# EAGLE design current (EAGLE 7.7.0)
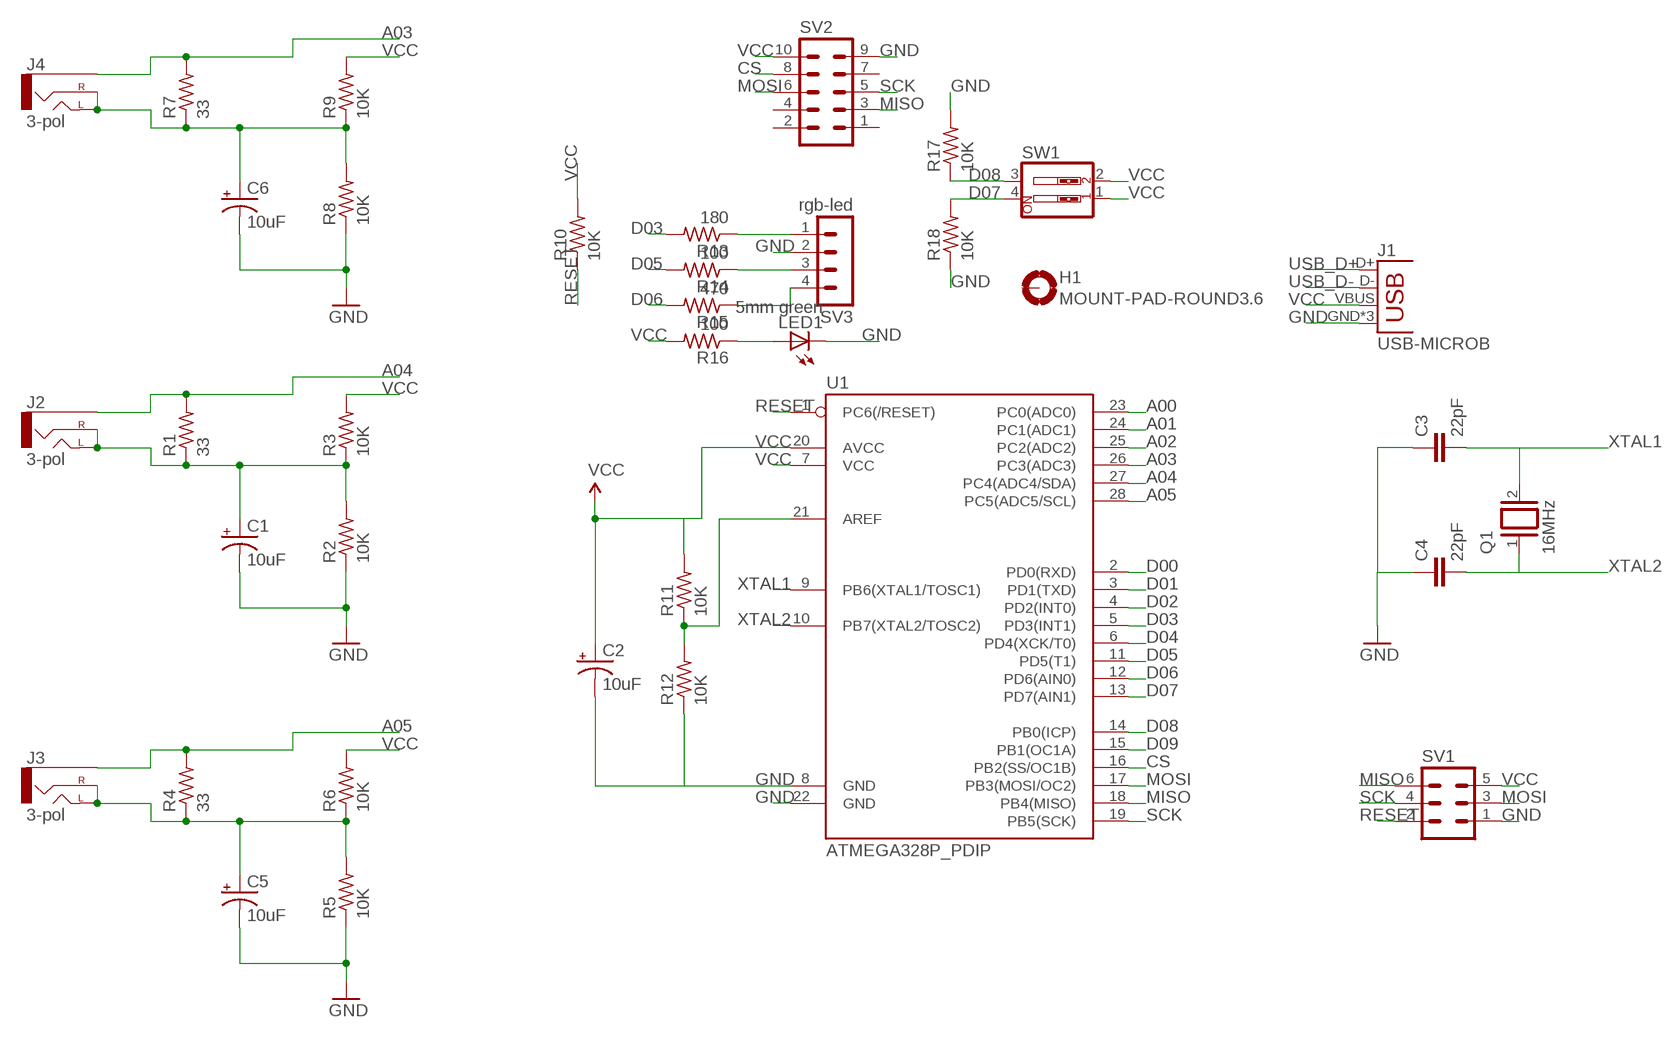
[diagram p0: schematic, sheet 1]

## Parts
C1  10uF  CAP_POLPTH1  [CPOL-RADIAL-100UF-25V]
C2  10uF  CAP_POLPTH2  [CPOL-RADIAL-10UF-25V]
C3  22pF  C5/2.5  [C5B2.5]
C4  22pF  C5/2.5  [C5B2.5]
C5  10uF  CAP_POLPTH1  [CPOL-RADIAL-100UF-25V]
C6  10uF  CAP_POLPTH1  [CPOL-RADIAL-100UF-25V]
H1  MOUNT-PAD-ROUND3.6  [3,6-PAD]
J1  USB-MICROB  [USB-MICROB]
J2  3-pol  AUDIO-JACKPTH  [AUDIO-JACK]
J3  3-pol  AUDIO-JACKPTH  [AUDIO-JACK]
J4  3-pol  AUDIO-JACKPTH  [AUDIO-JACK]
LED1  5mm green  LED5MM  [LED5MM]
Q1  16MHz  XTAL/S  [QS]
R1  33  R-US_0204/5  [0204/5]
R2  10K  R-US_0204/5  [0204/5]
R3  10K  R-US_0204/5  [0204/5]
R4  33  R-US_0204/5  [0204/5]
R5  10K  R-US_0204/5  [0204/5]
R6  10K  R-US_0204/5  [0204/5]
R7  33  R-US_0204/5  [0204/5]
R8  10K  R-US_0204/5  [0204/5]
R9  10K  R-US_0204/5  [0204/5]
R10  10K  R-US_0204/5  [0204/5]
R11  10K  R-US_0204/5  [0204/5]
R12  10K  R-US_0204/5  [0204/5]
R13  180  R-US_0204/5  [0204/5]
R14  100  R-US_0204/5  [0204/5]
R15  470  R-US_0204/5  [0204/5]
R16  100  R-US_0204/5  [0204/5]
R17  10K  R-US_0204/5  [0204/5]
R18  10K  R-US_0204/5  [0204/5]
SV1  MA03-2  [MA03-2]
SV2  MA05-2  [MA05-2]
SV3  rgb-led  MA04-1  [MA04-1]
SW1  SW_DIP-2  [EDG-02]
U1  ATMEGA328P_PDIP  [DIL28-3]

## Nets
A00: U1.23(PC0(ADC0))
A01: U1.24(PC1(ADC1))
A02: U1.25(PC2(ADC2))
A03: J4.SLEEVE R7.2 U1.26(PC3(ADC3))
A04: J2.SLEEVE R1.2 U1.27(PC4(ADC4/SDA))
A05: J3.SLEEVE R4.2 U1.28(PC5(ADC5/SCL))
CS: SV2.8 U1.16(PB2(SS/OC1B))
D00: U1.2(PD0(RXD))
D01: U1.3(PD1(TXD))
D02: U1.4(PD2(INT0))
D03: R13.2 U1.5(PD3(INT1))
D04: U1.6(PD4(XCK/T0))
D05: R14.2 U1.11(PD5(T1))
D06: R15.2 U1.12(PD6(AIN0))
D07: R18.2 SW1.4 U1.13(PD7(AIN1))
D08: R17.1 SW1.3 U1.14(PB0(ICP))
D09: U1.15(PB1(OC1A))
GND: C1.2(-) C2.2(-) C3.1 C4.1 C5.2(-) C6.2(-) J1.GND J1.MT1(GND) J1.MT2(GND) LED1.K(C) R2.1 R5.1 R8.1 R12.1 R17.2 R18.1 SV1.1 SV2.9 U1.8(GND) U1.22(GND)
MISO: SV1.6 SV2.3 U1.18(PB4(MISO))
MOSI: SV1.3 SV2.6 U1.17(PB3(MOSI/OC2))
N$1: C5.1(+) J3.RING(RIGHT) J3.TIP(LEFT) R4.1 R5.2 R6.1
N$2: C1.1(+) J2.RING(RIGHT) J2.TIP(LEFT) R1.1 R2.2 R3.1
N$3: C6.1(+) J4.RING(RIGHT) J4.TIP(LEFT) R7.1 R8.2 R9.1
N$4: R13.1 SV3.1
N$5: R11.1 R12.2 U1.21(AREF)
N$6: R14.1 SV3.3
N$7: R15.1 SV3.4
N$8: LED1.A R16.1
RESET: R10.1 SV1.2 U1.1(PC6(/RESET))
SCK: SV1.4 SV2.5 U1.19(PB5(SCK))
USB_D+: J1.D+
USB_D-: J1.D-
VCC: C2.1(+) J1.VBUS R3.2 R6.2 R9.2 R10.2 R11.2 R16.2 SV1.5 SV2.10 SW1.1 SW1.2 U1.7(VCC) U1.20(AVCC)
XTAL1: C3.2 Q1.2 U1.9(PB6(XTAL1/TOSC1))
XTAL2: C4.2 Q1.1 U1.10(PB7(XTAL2/TOSC2))
Unconnected: H1.B3,6(MOUNT) SV2.1 SV2.2 SV2.4 SV2.7 SV3.2

## Library data of the parts
C1 C5 C6 = SparkFun-Passives:CAP_POL: Capacitor Polarized These are standard SMD and PTH capacitors. Normally 10uF, 47uF, and 100uF in electrolytic and tantalum varieties. Always verify the external diameter of the through hole cap, it varies with capacity, voltage, and manufacturer. The EIA devices should be standard.
C2 = SparkFun-Capacitors:CAP_POL: Capacitor Polarized These are standard SMD and PTH capacitors. Normally 10uF, 47uF, and 100uF in electrolytic and tantalum varieties. Always verify the external diameter of the through hole cap, it varies with capacity, voltage, and manufacturer. The EIA devices should be standard.
C3 C4 = capacitor-wima:C: CAPACITOR naming: grid - package width
H1 = holes:MOUNT-PAD-ROUND: MOUNTING PAD, round
J1 = SparkFun-Connectors:USB: USB Connectors USB-B-PTH is fully proven SKU : PRT-00139/CONN-08278 USB-miniB is fully proven SKU : PRT-00587 USB-A-PCB is untested. USB-A-H is throughly reviewed, but untested. Spark Fun Electronics SKU : PRT-00437 USB-B-SMT is throughly reviewed, but untested. Needs silkscreen touching up. USB-A-S has not been used/tested USB-MB-H has not been used/tested USB-MICROB has been used. CONN-09505; PROD_ID: CONN-09505
J2-J4 = SparkFun-Connectors:AUDIO-JACK: 3.5mm Audio Jack Simple 3.5mm common PCB mount audio jack. Variant PTH is our storefront SKU PRT-08032
LED1 = led:LED: LED OSRAM: - CHIPLED LG R971, LG N971, LY N971, LG Q971, LY Q971, LO R971, LY R971 LH N974, LH R974 LS Q976, LO Q976, LY Q976 LO Q996 - Hyper CHIPLED LW Q18S LB Q993, LB Q99A, LB R99A - SideLED LS A670, LO A670, LY A670, LG A670, LP A670 LB A673, LV A673, LT A673, LW A673 LH A674 LY A675 LS A676, LA A676, LO A676, LY A676, LW A676 LS A679, LY A679, LG A679 - Hyper Micro SIDELED® LS Y876, LA Y876, LO Y876, LY Y876 LT Y87S - SmartLED LW L88C, LW L88S LB L89C, LB L89S, LG L890 LS L89K, LO L89K, LY L89K LS L896, LA L896, LO L896, LY L896 - TOPLED LS T670, LO T670, LY T670, LG T670, LP T670 LSG T670, LSP T670, LSY T670, LOP T670, LYG T670 LG T671, LOG T671, LSG T671 LB T673, LV T673, LT T673, LW T673 LH T674 LS T676, LA T676, LO T676, LY T676, LB T676, LH T676, LSB T676, LW T676 LB T67C, LV T67C, LT T67C, LS T67K, LO T67K, LY T67K, LW E67C LS E67B, LA E67B, LO E67B, LY E67B, LB E67C, LV E67C, LT E67C LW T67C LS T679, LY T679, LG T679 LS T770, LO T770, LY T770, LG T770, LP T770 LB T773, LV T773, LT T773, LW T773 LH T774 LS E675, LA E675, LY E675, LS T675 LS T776, LA T776, LO T776, LY T776, LB T776 LHGB T686 LT T68C, LB T68C - Hyper Mini TOPLED® LB M676 - Mini TOPLED Santana® LG M470 LS M47K, LO M47K, LY M47K Source: http://www.osram.convergy.de LUXEON: - LUMILED® LXK2-PW12-R00, LXK2-PW12-S00, LXK2-PW14-U00, LXK2-PW14-V00 LXK2-PM12-R00, LXK2-PM12-S00, LXK2-PM14-U00 LXK2-PE12-Q00, LXK2-PE12-R00, LXK2-PE12-S00, LXK2-PE14-T00, LXK2-PE14-U00 LXK2-PB12-K00, LXK2-PB12-L00, LXK2-PB12-M00, LXK2-PB14-N00, LXK2-PB14-P00, LXK2-PB14-Q00 LXK2-PR12-L00, LXK2-PR12-M00, LXK2-PR14-Q00, LXK2-PR14-R00 LXK2-PD12-Q00, LXK2-PD12-R00, LXK2-PD12-S00 LXK2-PH12-R00, LXK2-PH12-S00 LXK2-PL12-P00, LXK2-PL12-Q00, LXK2-PL12-R00 Source: www.luxeon.com KINGBRIGHT: KA-3528ASYC Source: www.kingbright.com
Q1 = special:XTAL/S: CRYSTAL
R1-R18 = resistor:R-US_: RESISTOR, American symbol
SV1 = con-lstb:MA03-2: PIN HEADER; OC_FARNELL: unknown; OC_NEWARK: unknown
SV2 = con-lstb:MA05-2: PIN HEADER; OC_FARNELL: unknown; OC_NEWARK: unknown
SV3 = con-lstb:MA04-1: PIN HEADER; OC_FARNELL: unknown; OC_NEWARK: unknown
SW1 = special:SW_DIP-2: DIP SWITCH
U1 = SparkFun-DigitalIC:ATMEGA328P_PDIP: uC used in the Arduino 32kb flash, 1k EEPROM, 2k SRAM This is the through-hole version of this chip.

## Board
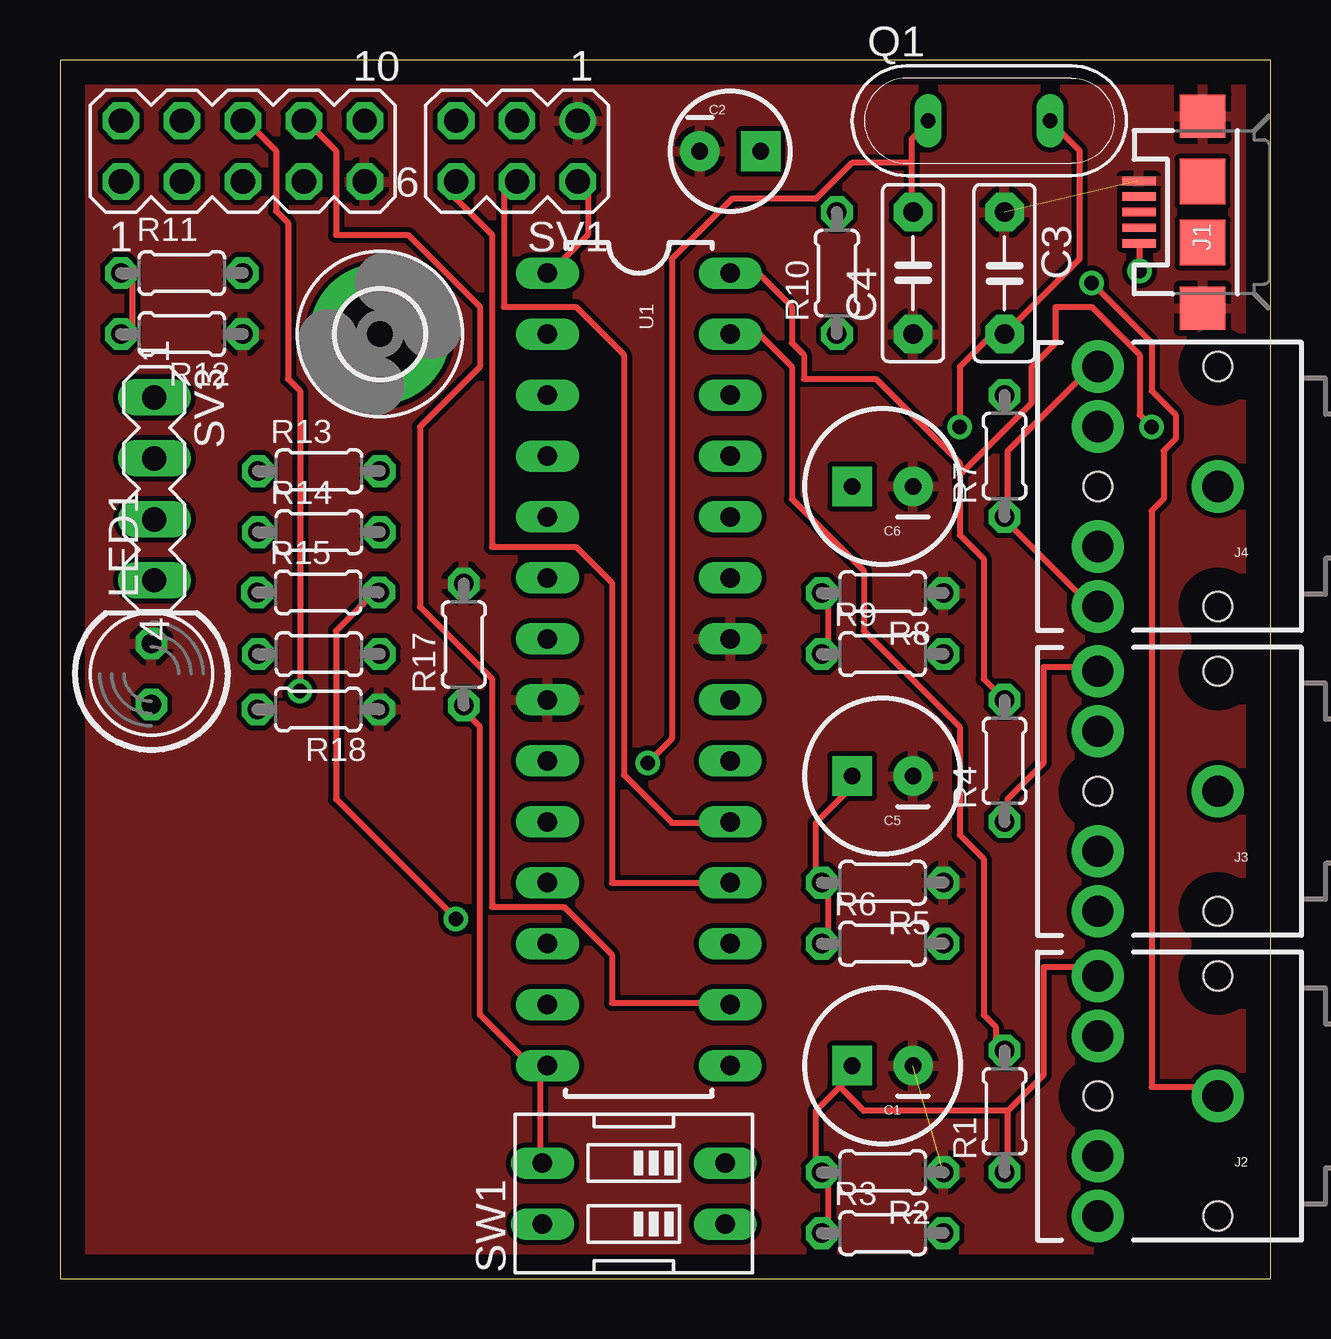
[diagram p1: board, top side]
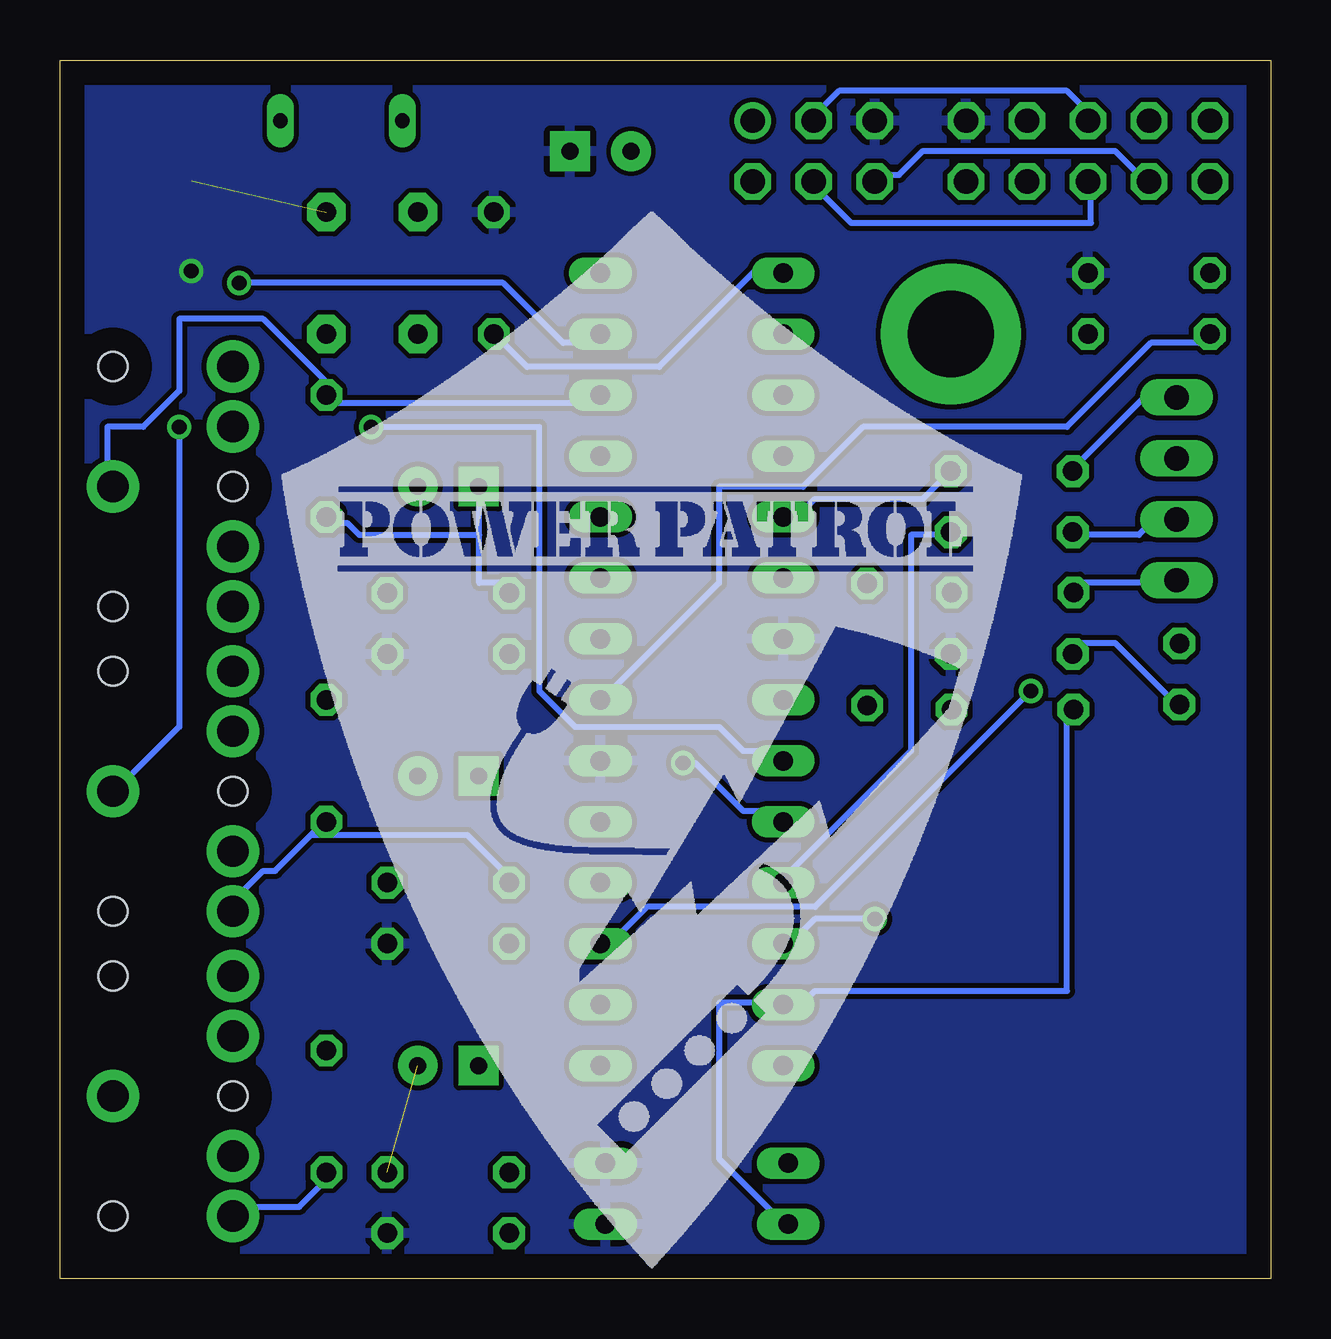
[diagram p2: board, bottom side, seen from below]

Size 50.47 x 50.79 mm. Coordinates in mm from the lower left corner, seen from the top.
Outline: 0,0 50.47,0 50.47,50.79 0,50.79 0,0
Copper layers (1*16): Top 0.035mm / dielectric 1.5mm / Bottom 0.035mm
Design rules "default": minimum track width 10mil, minimum drill 24mil, track to track 8mil, track to pad 8mil, pad to pad 8mil, via to via 8mil, smd to smd 8mil, copper to edge 40mil, drill to drill 8mil, minimum pad ring 10mil, minimum via ring 8mil, stop-mask expansion 4mil, vias tented up to drill 0mil, thermal gap 10mil

### Footprints (pad centres in the part's own frame; a part is rotated, then mirrored left to right if it is on the bottom)
CPOL-RADIAL-100UF-25V = drill 0.7 pad 1.651 square: 1 1.27,0 | drill 0.7 pad 1.651: 2 -1.27,0
CPOL-RADIAL-10UF-25V = drill 0.7 pad 1.651 square: 1 1.27,0 | drill 0.7 pad 1.651: 2 -1.27,0
C5B2.5 = drill 0.813 pad 1.6 octagon: 1 -2.54,0; 2 2.54,0
3,6-PAD = drill 3.6 pad 5.842: B3,6 0,0
USB-MICROB = smd 0.35 x 1.4: D+ 0,2.65; D- -0.65,2.65; GND 1.3,2.65; ID 0.65,2.65; VBUS -1.3,2.65 | smd 1.8 x 1.9: MT1 -4,0; MT2 4,0 | smd 1.9 x 1.9: P$1 -1.27,0; P$2 1.27,0
AUDIO-JACK = drill 1.3 pad 2.184: RING 5,5; RSH 5,2.5; SLEEVE 0,0; TIP 5,-5; TSH 5,-2.5 | hole 1.2: 0,5; 0,-5; 5,0
LED5MM = drill 0.813 octagon: A -1.27,0; K 1.27,0
QS = drill 0.61 long: 1 -2.54,0; 2 2.54,0
0204/5 = drill 0.813 octagon: 1 -2.54,0; 2 2.54,0
MA03-2 = drill 1.016: 1 -2.54,-1.27 | drill 1.016 octagon: 2 -2.54,1.27; 3 0,-1.27; 4 0,1.27; 5 2.54,-1.27; 6 2.54,1.27
MA05-2 = drill 1.016 octagon: 1 -5.08,-1.27; 2 -5.08,1.27; 3 -2.54,-1.27; 4 -2.54,1.27; 5 0,-1.27; 6 0,1.27; 7 2.54,-1.27; 8 2.54,1.27; 9 5.08,-1.27; 10 5.08,1.27
MA04-1 = drill 1.016 long: 1 -3.81,0; 2 -1.27,0; 3 1.27,0; 4 3.81,0
EDG-02 = drill 0.813 long: 1 -1.27,-3.81; 2 1.27,-3.81; 3 1.27,3.81; 4 -1.27,3.81
DIL28-3 = drill 0.813 long: 1 -16.51,-3.81; 2 -13.97,-3.81; 3 -11.43,-3.81; 4 -8.89,-3.81; 5 -6.35,-3.81; 6 -3.81,-3.81; 7 -1.27,-3.81; 8 1.27,-3.81; 9 3.81,-3.81; 10 6.35,-3.81; 11 8.89,-3.81; 12 11.43,-3.81; 13 13.97,-3.81; 14 16.51,-3.81; 15 16.51,3.81; 16 13.97,3.81; 17 11.43,3.81; 18 8.89,3.81; 19 6.35,3.81; 20 3.81,3.81; 21 1.27,3.81; 22 -1.27,3.81; 23 -3.81,3.81; 24 -6.35,3.81; 25 -8.89,3.81; 26 -11.43,3.81; 27 -13.97,3.81; 28 -16.51,3.81

### Placement (x,y rotation side)
C1  34.29,8.89 180 top
C2  27.94,46.99 0 top
C3  39.37,41.91 270 top
C4  35.56,41.91 90 top
C5  34.29,20.95 180 top
C6  34.29,33.02 180 top
H1  13.34,39.37 0 top
J1  47.62,44.45 90 top
J2  48.26,7.62 180 top
J3  48.26,20.32 180 top
J4  48.26,33.02 180 top
LED1  3.81,25.21 90 top
Q1  38.73,48.26 0 top
R1  39.37,6.99 90 top
R2  34.29,4.45 180 top
R3  34.29,1.91 0 top
R4  39.37,21.59 90 top
R5  34.29,16.51 180 top
R6  34.29,13.97 0 top
R7  39.37,34.29 90 top
R8  34.29,28.57 180 top
R9  34.29,26.04 0 top
R10  32.38,41.91 90 top
R11  5.08,41.91 0 top
R12  5.08,39.37 180 top
R13  10.79,33.66 0 top
R14  10.79,31.11 0 top
R15  10.76,28.61 0 top
R16  10.79,26.04 0 top
R17  16.83,26.43 90 top
R18  10.77,23.73 180 top
SV1  19.05,46.99 180 top
SV2  7.62,46.99 0 top
SV3  3.93,32.92 270 top
SW1  23.92,3.56 90 top
U1  24.13,25.4 270 top

### Tracks (layer width: path | path; a pad name or v marks a point on that pad's centre or on a via)
A03
  Bottom 0.254: U1.26 28,36.5 39,36.5 R7.2 39,37 42,40 45.5,40 45.5,37 47,35.5 48.5,35.5 48.5,33.5 J4.SLEEVE
A04  (via drill 0.61)
  Top 0.254: R1.2 39,10 39,10.5 38.5,11 38.5,17.5 37.5,18.5 37.5,23 33.5,27 33.5,29.5 30.5,32.5 30.5,38 29,39.5 28,39.5 U1.27 | v43,41.5 45.5,39 45.5,37 46.5,36 46.5,35 46,34.5 46,32.5 45.5,32 45.5,8 48,8 J2.SLEEVE
  Bottom 0.254: v43,41.5 32,41.5 29.5,39 28,39 U1.27
A05  (via drill 0.61)
  Top 0.254: R4.2 38.5,25 38.5,30 37.5,31 37.5,33.5 | 37.5,33.5 37.5,34 34,37.5 31,37.5 31,38.5 30.5,39 30.5,40.5 29,42 28,42 U1.28 | v45.5,35.5 45,36 45,38.5 43,40.5 41.5,40.5 41.5,39 40.5,38 40.5,36.5 37.5,33.5
  Bottom 0.254: v45.5,35.5 45.5,23 48,20.5 J3.SLEEVE
CS
  Top 0.254: U1.16 27.5,11.5 23,11.5 23,13.5 21,15.5 18,15.5 18,25 15,28 15,35.5 17.5,38 17.5,40.5 14.5,43.5 11.5,43.5 11.5,47 10.5,48 SV2.8
D03
  Bottom 0.254: R13.2 13.5,33.5 14.5,32.5 19,32.5 19.5,32 20,32 U1.5
D05
  Bottom 0.254: U1.11 20,17 15,22 15,31 13.5,31 R14.2
D06  (via drill 0.61)
  Top 0.254: v16.5,15 11.5,20 11.5,27 13,28.5 R15.2
  Bottom 0.254: v16.5,15 19,15 20,14 U1.12
D07
  Bottom 0.254: SW1.4 20.5,2.5 23,5 23,11.5 20.5,11.5 U1.13 20,11.5 19.5,11.5 19,12 8.5,12 8.5,23.5 R18.2
D08
  Top 0.254: 20,8.5 20,5 SW1.3 | 20,8.5 17.5,11 17.5,23 17,23.5 R17.1 | 20,8.5 U1.14
GND  (2 unrouted)
  pour Top: 0.26,50.39 50.16,50.39 50.16,0 0.64,0
MISO
  Top 0.254: U1.18 27.5,16.5 23,16.5 23,29 21.5,30.5 18,30.5 18,43.5 16.5,45 16.5,45.5 SV1.6
  Bottom 0.254: SV2.3 5.5,46 6.5,47 14.5,47 15.5,46 16.5,46 SV1.6
MOSI  (via drill 0.61)
  Top 0.254: v10,24.5 10,37 9.5,37.5 9.5,44 9,44.5 9,47 8,48 SV2.6
  Bottom 0.254: v10,24.5 19,15.5 26,15.5 27.5,14 U1.17 | SV1.3 19,48.5 18,49.5 8.5,49.5 7.5,48.5 SV2.6
N$1
  Top 0.254: R6.1 32,14 32,16.5 R5.2 31.5,17 31.5,19 33,20.5 C5.1 | J3.TIP 43,25.5 41,25.5 41,21.5 39.5,20 39.5,19.5 R4.1
  Bottom 0.254: 40,18.5 41.5,17 42,17 43.5,15.5 J3.RING | 40,18.5 39.5,19 R4.1 | 40,18.5 33.5,18.5 32,17 R5.2
N$2
  Top 0.254: R3.1 32,2 32,4 R2.2 31.5,4.5 31.5,7 32.5,8 | 32.5,8 33,8.5 C1.1 | 39.5,7 41,8.5 41,13 43,13 J2.TIP | 39.5,7 39.5,4.5 R1.1 | 32.5,8 33.5,7 39.5,7
  Bottom 0.254: R1.1 39.5,4 40.5,3 43,3 J2.RING
N$3
  Top 0.254: R9.1 32,26.5 32,28.5 R8.2 | J4.RING 43,28 39.5,31.5 R7.1 39.5,32 39.5,34.5 43,38 J4.TIP
  Bottom 0.254: 33,31 33,29 32,29 R8.2 | 33,31 33,33 C6.1 | 33,31 38,31 38.5,31.5 39,31.5 R7.1
N$4
  Bottom 0.254: R13.1 8,34 5,37 4,37 SV3.1
N$5
  Top 0.254: R12.2 3,39.5 3,41.5 R11.1
  Bottom 0.254: U1.21 27.5,24.5 23,29 23,33 19.5,33 17,35.5 8.5,35.5 5,39 3,39 R12.2
N$6
  Bottom 0.254: R14.1 8,31 5.5,31 5,31.5 4,31.5 SV3.3
N$7
  Bottom 0.254: R15.1 8,29 4,29 SV3.4
N$8
  Bottom 0.254: LED1.A 4,24 6.5,26.5 8,26.5 R16.1
RESET
  Top 0.254: U1.1 20.5,42 22,43.5 22,45.5 SV1.2
  Bottom 0.254: R10.1 32,39 31,38 25.5,38 21.5,42 20.5,42 U1.1
SCK
  Top 0.254: U1.19 27.5,19 25.5,19 23.5,21 23.5,38.5 21.5,40.5 18.5,40.5 18.5,45.5 19,46 SV1.4
  Bottom 0.254: SV2.5 7.5,45.5 7.5,44 17.5,44 19,45.5 SV1.4
VCC  (via drill 0.61)
  Top 0.254: v45,42 45,43 J1.VBUS
  pour Bottom: 0.64,0.64 50.16,0.64 50.16,50.16 0.64,50.16
XTAL1  (via drill 0.61)
  Top 0.254: Q1.2 41.5,48 42.5,47 42.5,42.5 C3.2 39,39.5 37.5,38 v37.5,35.5
  Bottom 0.254: v37.5,35.5 30.5,35.5 30.5,24.5 29,23 23,23 22,22 20.5,22 U1.9
XTAL2  (via drill 0.61)
  Top 0.254: 35.5,46.5 35.5,44.5 C4.2 | 35.5,46.5 35.5,47.5 36,48 Q1.1 | v24.5,21.5 25.5,22.5 25.5,42.5 28,45 31.5,45 33,46.5 35.5,46.5
  Bottom 0.254: v24.5,21.5 24,21.5 22,19.5 20.5,19.5 U1.10